# EAGLE schematic F2CE_V3_Main (EAGLE 9.6.2)
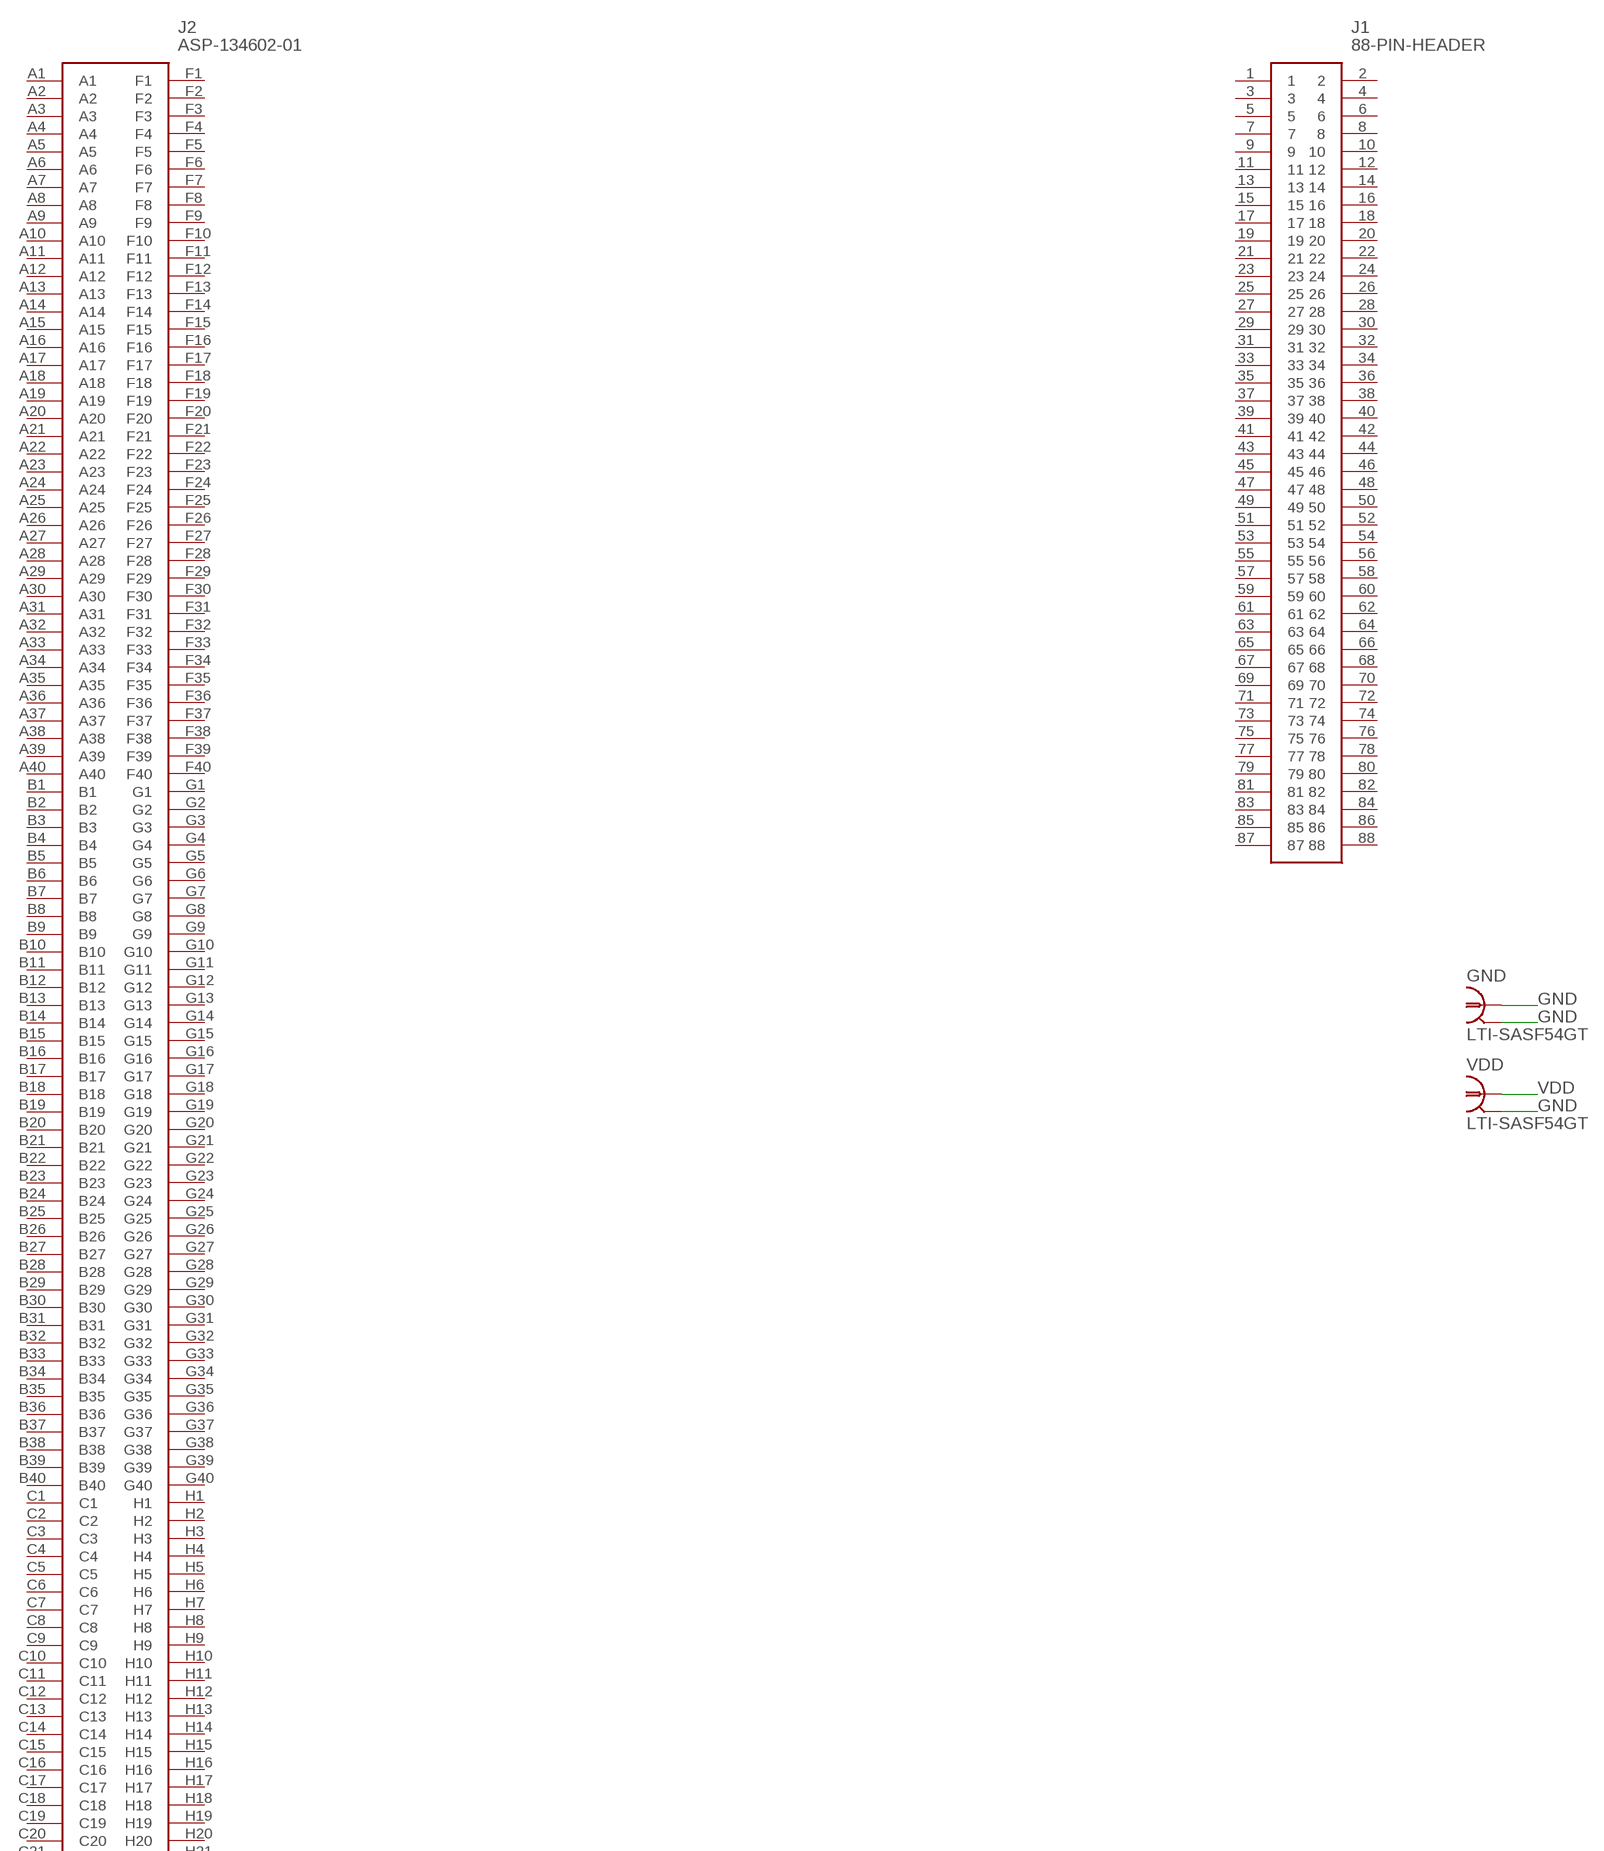
[diagram p0: schematic, sheet 1, part 1 of 2]
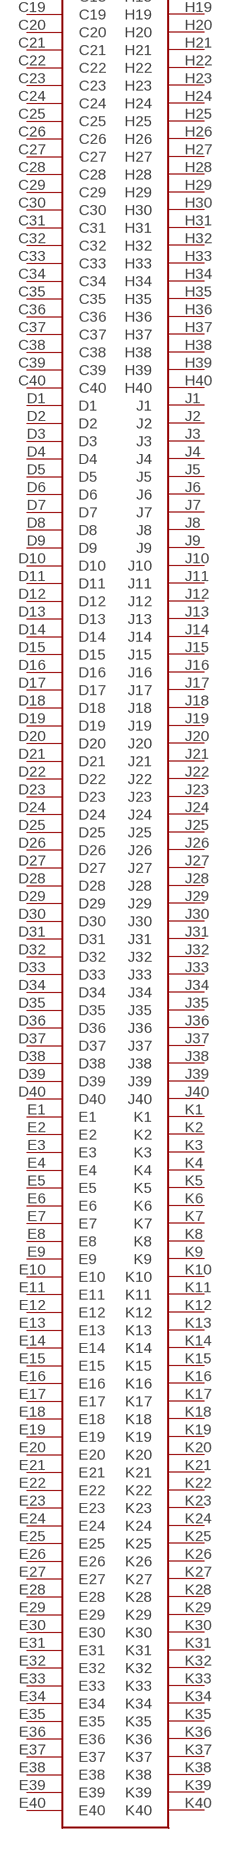
[diagram p1: schematic, sheet 1, part 2 of 2]

## Parts
GND  LTI-SASF54GT  [LTI-SASF54GT]
J1  88-PIN-HEADER  [88-PIN-HEADER]
J2  ASP-134602-01  [ASP13460201]
VDD  LTI-SASF54GT  [LTI-SASF54GT]

## Nets
GND: GND.1 GND.2 GND.3 GND.4 GND.5 VDD.2 VDD.3 VDD.4 VDD.5
VDD: VDD.1
Unconnected: J1.1 J1.2 J1.3 J1.4 J1.5 J1.6 J1.7 J1.8 J1.9 J1.10 J1.11 J1.12 J1.13 J1.14 J1.15 J1.16 J1.17 J1.18 J1.19 J1.20 J1.21 J1.22 J1.23 J1.24 J1.25 J1.26 J1.27 J1.28 J1.29 J1.30 J1.31 J1.32 J1.33 J1.34 J1.35 J1.36 J1.37 J1.38 J1.39 J1.40 J1.41 J1.42 J1.43 J1.44 J1.45 J1.46 J1.47 J1.48 J1.49 J1.50 J1.51 J1.52 J1.53 J1.54 J1.55 J1.56 J1.57 J1.58 J1.59 J1.60 J1.61 J1.62 J1.63 J1.64 J1.65 J1.66 J1.67 J1.68 J1.69 J1.70 J1.71 J1.72 J1.73 J1.74 J1.75 J1.76 J1.77 J1.78 J1.79 J1.80 J1.81 J1.82 J1.83 J1.84 J1.85 J1.86 J1.87 J1.88 J2.A1 J2.A2 J2.A3 J2.A4 J2.A5 J2.A6 J2.A7 J2.A8 J2.A9 J2.A10 J2.A11 J2.A12 J2.A13 J2.A14 J2.A15 J2.A16 J2.A17 J2.A18 J2.A19 J2.A20 J2.A21 J2.A22 J2.A23 J2.A24 J2.A25 J2.A26 J2.A27 J2.A28 J2.A29 J2.A30 J2.A31 J2.A32 J2.A33 J2.A34 J2.A35 J2.A36 J2.A37 J2.A38 J2.A39 J2.A40 J2.B1 J2.B2 J2.B3 J2.B4 J2.B5 J2.B6 J2.B7 J2.B8 J2.B9 J2.B10 J2.B11 J2.B12 J2.B13 J2.B14 J2.B15 J2.B16 J2.B17 J2.B18 J2.B19 J2.B20 J2.B21 J2.B22 J2.B23 J2.B24 J2.B25 J2.B26 J2.B27 J2.B28 J2.B29 J2.B30 J2.B31 J2.B32 J2.B33 J2.B34 J2.B35 J2.B36 J2.B37 J2.B38 J2.B39 J2.B40 J2.C1 J2.C2 J2.C3 J2.C4 J2.C5 J2.C6 J2.C7 J2.C8 J2.C9 J2.C10 J2.C11 J2.C12 J2.C13 J2.C14 J2.C15 J2.C16 J2.C17 J2.C18 J2.C19 J2.C20 J2.C21 J2.C22 J2.C23 J2.C24 J2.C25 J2.C26 J2.C27 J2.C28 J2.C29 J2.C30 J2.C31 J2.C32 J2.C33 J2.C34 J2.C35 J2.C36 J2.C37 J2.C38 J2.C39 J2.C40 J2.D1 J2.D2 J2.D3 J2.D4 J2.D5 J2.D6 J2.D7 J2.D8 J2.D9 J2.D10 J2.D11 J2.D12 J2.D13 J2.D14 J2.D15 J2.D16 J2.D17 J2.D18 J2.D19 J2.D20 J2.D21 J2.D22 J2.D23 J2.D24 J2.D25 J2.D26 J2.D27 J2.D28 J2.D29 J2.D30 J2.D31 J2.D32 J2.D33 J2.D34 J2.D35 J2.D36 J2.D37 J2.D38 J2.D39 J2.D40 J2.E1 J2.E2 J2.E3 J2.E4 J2.E5 J2.E6 J2.E7 J2.E8 J2.E9 J2.E10 J2.E11 J2.E12 J2.E13 J2.E14 J2.E15 J2.E16 J2.E17 J2.E18 J2.E19 J2.E20 J2.E21 J2.E22 J2.E23 J2.E24 J2.E25 J2.E26 J2.E27 J2.E28 J2.E29 J2.E30 J2.E31 J2.E32 J2.E33 J2.E34 J2.E35 J2.E36 J2.E37 J2.E38 J2.E39 J2.E40 J2.F1 J2.F2 J2.F3 J2.F4 J2.F5 J2.F6 J2.F7 J2.F8 J2.F9 J2.F10 J2.F11 J2.F12 J2.F13 J2.F14 J2.F15 J2.F16 J2.F17 J2.F18 J2.F19 J2.F20 J2.F21 J2.F22 J2.F23 J2.F24 J2.F25 J2.F26 J2.F27 J2.F28 J2.F29 J2.F30 J2.F31 J2.F32 J2.F33 J2.F34 J2.F35 J2.F36 J2.F37 J2.F38 J2.F39 J2.F40 J2.G1 J2.G2 J2.G3 J2.G4 J2.G5 J2.G6 J2.G7 J2.G8 J2.G9 J2.G10 J2.G11 J2.G12 J2.G13 J2.G14 J2.G15 J2.G16 J2.G17 J2.G18 J2.G19 J2.G20 J2.G21 J2.G22 J2.G23 J2.G24 J2.G25 J2.G26 J2.G27 J2.G28 J2.G29 J2.G30 J2.G31 J2.G32 J2.G33 J2.G34 J2.G35 J2.G36 J2.G37 J2.G38 J2.G39 J2.G40 J2.H1 J2.H2 J2.H3 J2.H4 J2.H5 J2.H6 J2.H7 J2.H8 J2.H9 J2.H10 J2.H11 J2.H12 J2.H13 J2.H14 J2.H15 J2.H16 J2.H17 J2.H18 J2.H19 J2.H20 J2.H21 J2.H22 J2.H23 J2.H24 J2.H25 J2.H26 J2.H27 J2.H28 J2.H29 J2.H30 J2.H31 J2.H32 J2.H33 J2.H34 J2.H35 J2.H36 J2.H37 J2.H38 J2.H39 J2.H40 J2.J1 J2.J2 J2.J3 J2.J4 J2.J5 J2.J6 J2.J7 J2.J8 J2.J9 J2.J10 J2.J11 J2.J12 J2.J13 J2.J14 J2.J15 J2.J16 J2.J17 J2.J18 J2.J19 J2.J20 J2.J21 J2.J22 J2.J23 J2.J24 J2.J25 J2.J26 J2.J27 J2.J28 J2.J29 J2.J30 J2.J31 J2.J32 J2.J33 J2.J34 J2.J35 J2.J36 J2.J37 J2.J38 J2.J39 J2.J40 J2.K1 J2.K2 J2.K3 J2.K4 J2.K5 J2.K6 J2.K7 J2.K8 J2.K9 J2.K10 J2.K11 J2.K12 J2.K13 J2.K14 J2.K15 J2.K16 J2.K17 J2.K18 J2.K19 J2.K20 J2.K21 J2.K22 J2.K23 J2.K24 J2.K25 J2.K26 J2.K27 J2.K28 J2.K29 J2.K30 J2.K31 J2.K32 J2.K33 J2.K34 J2.K35 J2.K36 J2.K37 J2.K38 J2.K39 J2.K40

## Library data of the parts
GND VDD = con-coax:LTI-SASF54GT: SMA vertical PCB thrue hole jack Source: Lighthorse Technologies, inc. SASF54GT.pdf; OC_FARNELL: unknown; OC_NEWARK: unknown
J1 = 88-PIN-HEADER:88-PIN-HEADER: Headers & Wire Housings CGrid Bkwy Hdr DR Rt DR RtPn 15''SAu 4Ckt Source: Datasheet <https://www.molex.com/pdm_docs/sd/702871098_sd.pdf>; DESCRIPTION: Headers & Wire Housings CGrid Bkwy Hdr DR Rt DR RtPn 15''SAu 4Ckt; HEIGHT: 8.51mm; MANUFACTURER_NAME: Molex; MANUFACTURER_PART_NUMBER: 70287-1098; MOUSER_PART_NUMBER: 538-70287-1098; MOUSER_PRICE-STOCK: https://www.mouser.co.uk/ProductDetail/Molex/70287-1098?qs=kYQSPAH4sJyJ%2F7vCw3ffjg%3D%3D
J2 = ASP-134602-01:ASP-134602-01: Samtec ASP Series 1.27mm Pitch 400 Way 10 Row PCB Socket, Through Hole, Solder Termination Source: Datasheet <https://componentsearchengine.com/Datasheets/2/ASP-134602-01.pdf>; DESCRIPTION: Samtec ASP Series 1.27mm Pitch 400 Way 10 Row PCB Socket, Through Hole, Solder Termination; HEIGHT: 5.74mm; MANUFACTURER_NAME: SAMTEC; MANUFACTURER_PART_NUMBER: ASP-134602-01; MOUSER_PART_NUMBER: 200-ASP-134602-01; MOUSER_PRICE-STOCK: https://www.mouser.co.uk/ProductDetail/Samtec/ASP-134602-01?qs=FESYatJ8odJXL2em%252Bh4I4Q%3D%3D